# Altium project PCB_ADVANCED.PrjPcb
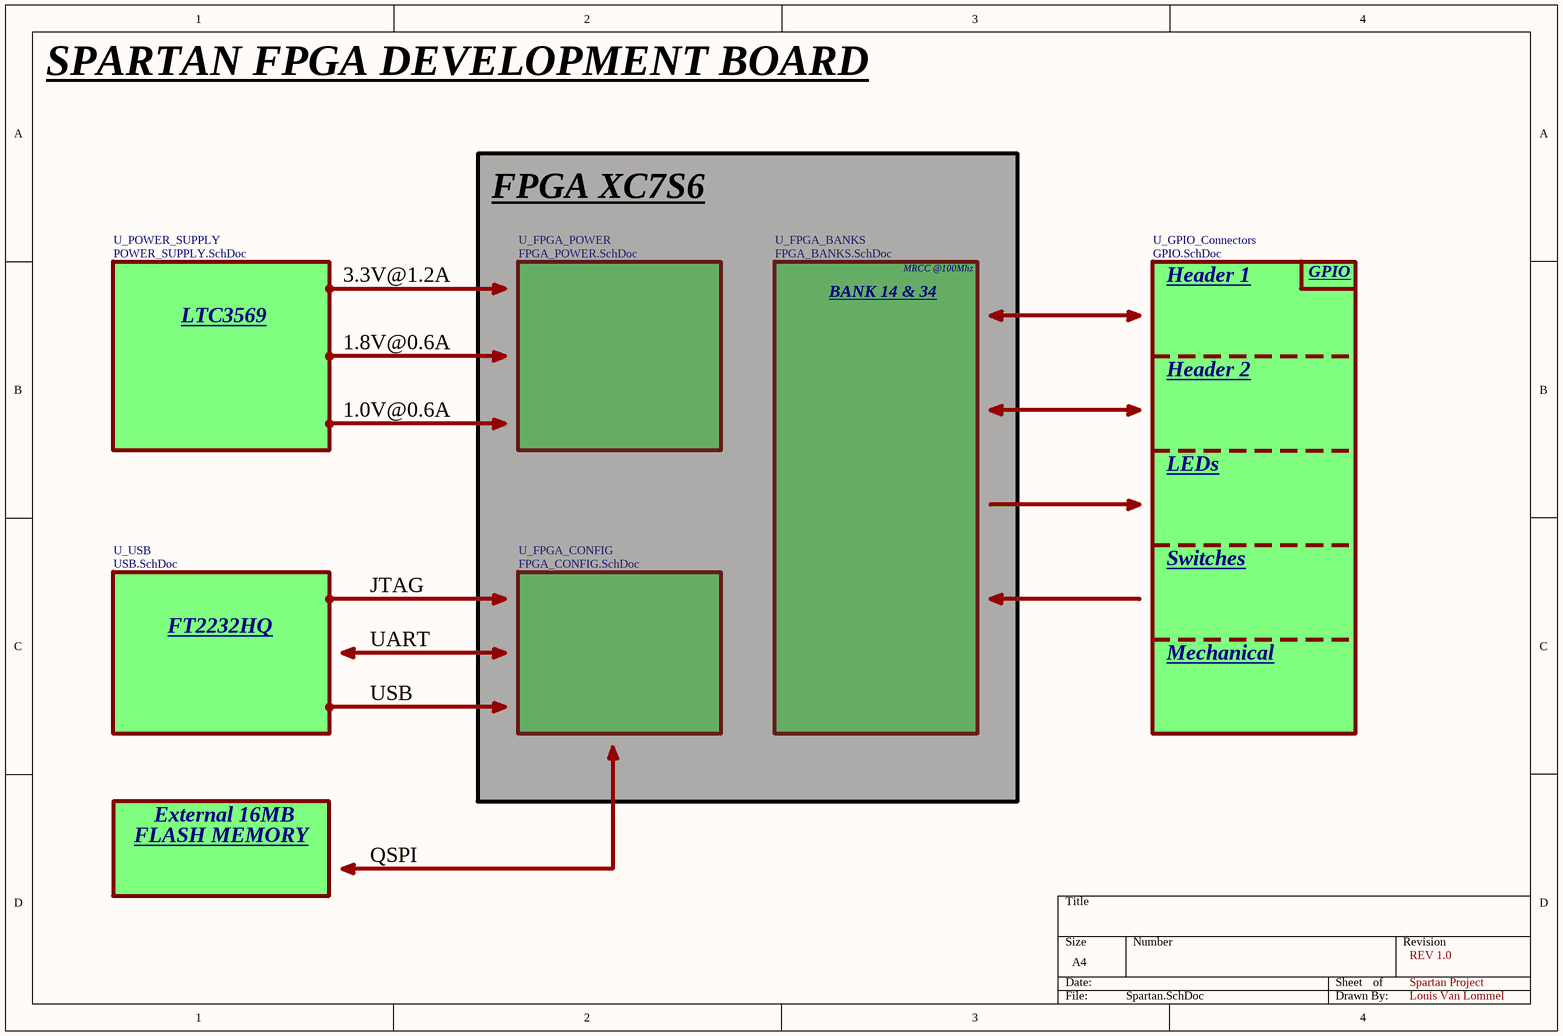
[diagram p0: Spartan.SchDoc]
7 sheets, 179 parts. Net scope: global (net labels, ports and power ports of the same name join across sheets).
Board files: PCB1.PcbDoc, PCB_PANEL.PcbDoc
Sheets:
  Spartan.SchDoc
    U_FPGA_POWER = FPGA_POWER.SchDoc
    U_POWER_SUPPLY = POWER_SUPPLY.SchDoc
    U_USB = USB.SchDoc
    U_FPGA_CONFIG = FPGA_CONFIG.SchDoc
    U_FPGA_BANKS = FPGA_BANKS.SchDoc
    U_GPIO_Connectors = GPIO.SchDoc

## Sheet Spartan.SchDoc
size A4

### Sub-sheets
U_FPGA_BANKS = FPGA_BANKS.SchDoc: no entries
U_FPGA_CONFIG = FPGA_CONFIG.SchDoc: no entries
U_FPGA_POWER = FPGA_POWER.SchDoc: no entries
U_GPIO_Connectors = GPIO.SchDoc: no entries
U_POWER_SUPPLY = POWER_SUPPLY.SchDoc: no entries
U_USB = USB.SchDoc: no entries

### Notes on the sheet
- SPARTAN FPGA DEVELOPMENT BOARD
- FPGA XC7S6
- 3.3V@1.2A
- BANK 14 & 34
- MRCC @100Mhz
- Header 1
- GPIO
- LTC3569
- 1.8V@0.6A
- Header 2
- 1.0V@0.6A
- LEDs
- Switches
- FT2232HQ
- JTAG
- UART
- USB
- Mechanical
- FLASH MEMORY
- External 16MB
- QSPI
- REV 1.0
- Spartan Project
- Louis Van Lommel

## Sheet FPGA_POWER.SchDoc
size A4
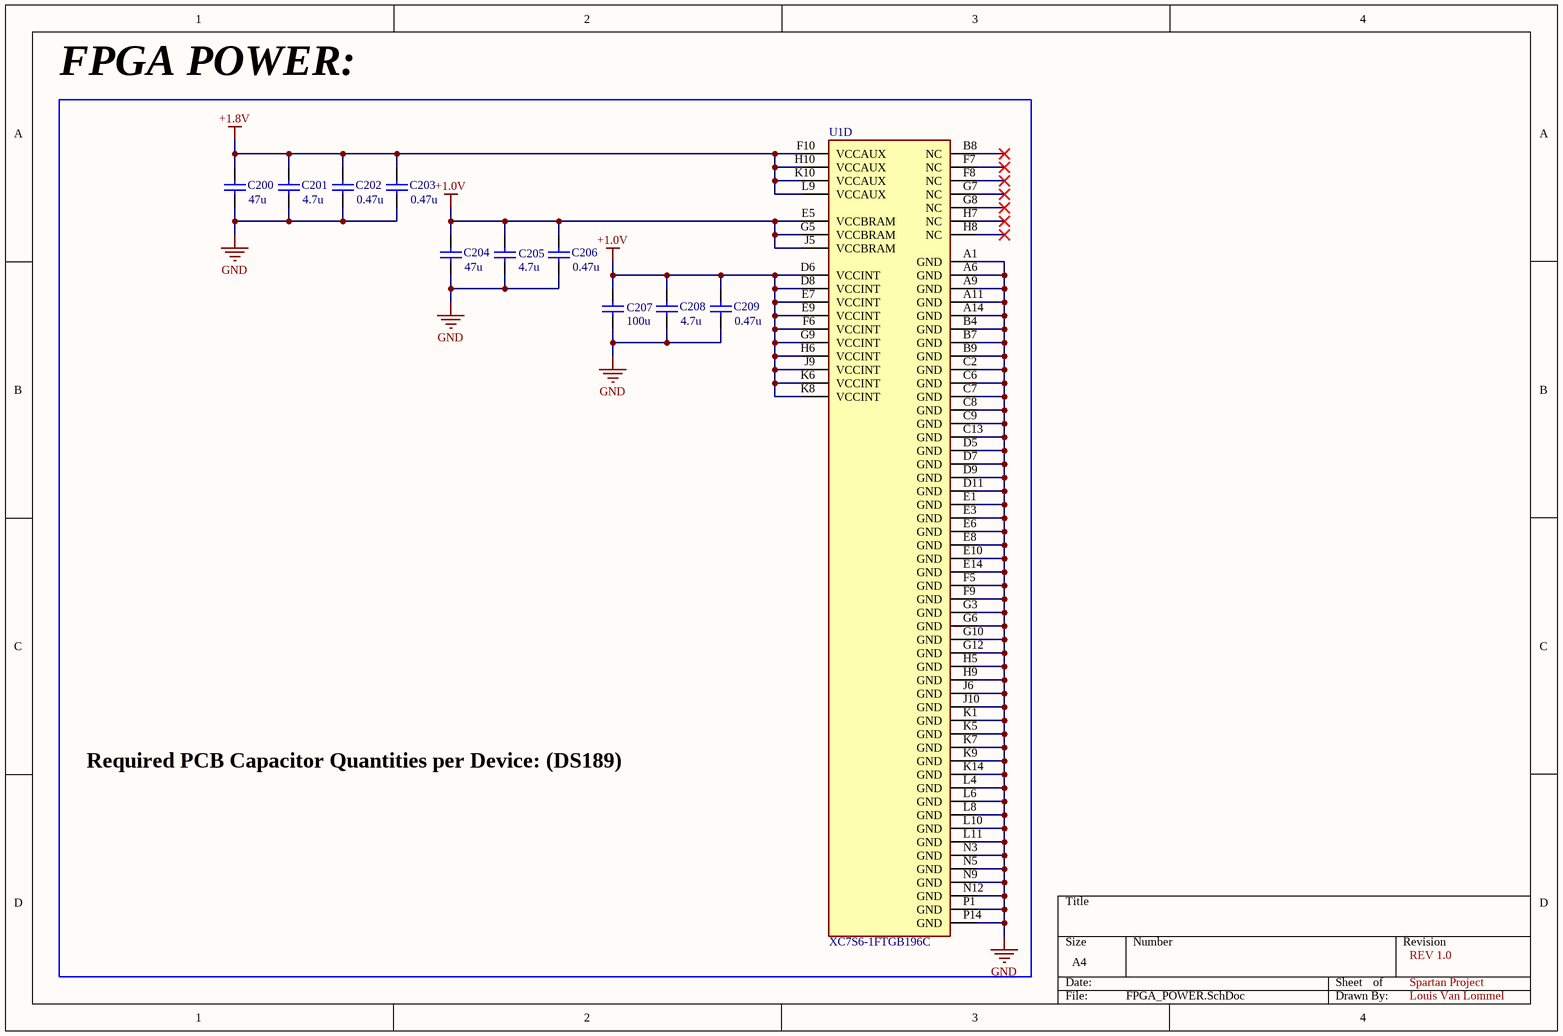
[diagram p1: FPGA_POWER.SchDoc]

### Parts
C200  value 47u  [CAP_0603]  (hidden comment: 47uF)
C201  4.7u  [CAP_0402]
C202  value 0.47u  [CAP_0402]  (hidden comment: 0.47uF)
C203  value 0.47u  [CAP_0402]  (hidden comment: 0.47uF)
C204  value 47u  [CAP_0603]  (hidden comment: 47uF)
C205  4.7u  [CAP_0402]
C206  value 0.47u  [CAP_0402]  (hidden comment: 0.47uF)
C207  value 100u  [CAP_0805]  (hidden comment: 100uF)
C208  4.7u  [CAP_0402]
C209  value 0.47u  [CAP_0402]  (hidden comment: 0.47uF)
U1  XC7S6-1FTGB196C  [FP-XC7S6-1FTGB196C-MFG]  (part D of 4)

### Nets
+1.0V: C204.2 C205.2 C206.2 C207.2 C208.2 C209.2 U1.D6(VCCINT) U1.D8(VCCINT) U1.E5(VCCBRAM) U1.E7(VCCINT) U1.E9(VCCINT) U1.F6(VCCINT) U1.G5(VCCBRAM) U1.G9(VCCINT) U1.H6(VCCINT) U1.J5(VCCBRAM) U1.J9(VCCINT) U1.K6(VCCINT) U1.K8(VCCINT)
+1.8V: C200.2 C201.2 C202.2 C203.2 U1.F10(VCCAUX) U1.H10(VCCAUX) U1.K10(VCCAUX) U1.L9(VCCAUX)
GND: C200.1 C201.1 C202.1 C203.1 C204.1 C205.1 C206.1 C207.1 C208.1 C209.1 U1.A1(GND) U1.A6(GND) U1.A9(GND) U1.A11(GND) U1.A14(GND) U1.B4(GND) U1.B7(GND) U1.B9(GND) U1.C2(GND) U1.C6(GND) U1.C7(GND) U1.C8(GND) U1.C9(GND) U1.C13(GND) U1.D5(GND) U1.D7(GND) U1.D9(GND) U1.D11(GND) U1.E1(GND) U1.E3(GND) U1.E6(GND) U1.E8(GND) U1.E10(GND) U1.E14(GND) U1.F5(GND) U1.F9(GND) U1.G3(GND) U1.G6(GND) U1.G10(GND) U1.G12(GND) U1.H5(GND) U1.H9(GND) U1.J6(GND) U1.J10(GND) U1.K1(GND) U1.K5(GND) U1.K7(GND) U1.K9(GND) U1.K14(GND) U1.L4(GND) U1.L6(GND) U1.L8(GND) U1.L10(GND) U1.L11(GND) U1.N3(GND) U1.N5(GND) U1.N9(GND) U1.N12(GND) U1.P1(GND) U1.P14(GND)

Not connected (* = marked no-connect by the designer): U1 B8(NC)* F7(NC)* F8(NC)* G7(NC)* G8(NC)* H7(NC)* H8(NC)*

### Notes on the sheet
- FPGA POWER:
- Required PCB Capacitor Quantities per Device: (DS189)
- REV 1.0
- Spartan Project
- Louis Van Lommel

### Library data of the parts
C200-C209 = Cap: Capacitor; Published: 8-Jun-2000; LatestRevisionDate: 17-Jul-2002; LatestRevisionNote: Re-released for DXP Platform.; PackageReference: RAD-0.3; Publisher: Altium Limited; PackageDescription: Radial Cap, Thru-Hole; 2 Leads; 0.3 in Pin Spacing
  C201 C205 C208: Value: 4.7u
U1 = CMP-17530-000008-1: Manufacturer: Xilinx; Standoff Height: 0.3mm; Max Supply Voltage: 3.465V; Number Of Logic Elements Cells: 6000; Number Of I/Os: 100; Min Supply Voltage: 0.95V; Ram Size: 180Kbits; Frequency: 200MHz; Max Junction Temp: +85°C; Speed Grade: 1; Propagation Delay: 0.13ns; Number Of Logic Blocks: 938; Lead Free: Yes; Device Class L1: Integrated Circuits (ICs); Category: IC; Ipc Land Pattern Name: BGA196C100P14X14_1500X1500X146; Manufacturer Part Number: XC7S6-1FTGB196C; Temperature Range High: +85°C; ComponentLink2Description: Datasheet; Package: XC7S6-1FTGB196C; Height: 1.55mm; Device Class L2: Embedded Processors and Controllers; Digikey Description: XC7S6-1FTGB196C; Temperature: 0°C to +85°C; Device Class L3: FPGAs - Field Programmable Gate Arrays; Automotive: No; Octopart: https://octopart.com/xc7s6-1ftgb196c-xilinx-81890684; Footprint Url: https://www.xilinx.com/support/documentation/user_guides/ug475_7Series_Pkg_Pinout.pdf; ComponentLink2URL: https://www.xilinx.com/support/documentation/data_sheets/ds189-spartan-7-data-sheet.pdf; RoHS: TRUE; Temperature Range Low: 0°C

## Sheet POWER_SUPPLY.SchDoc
size A4
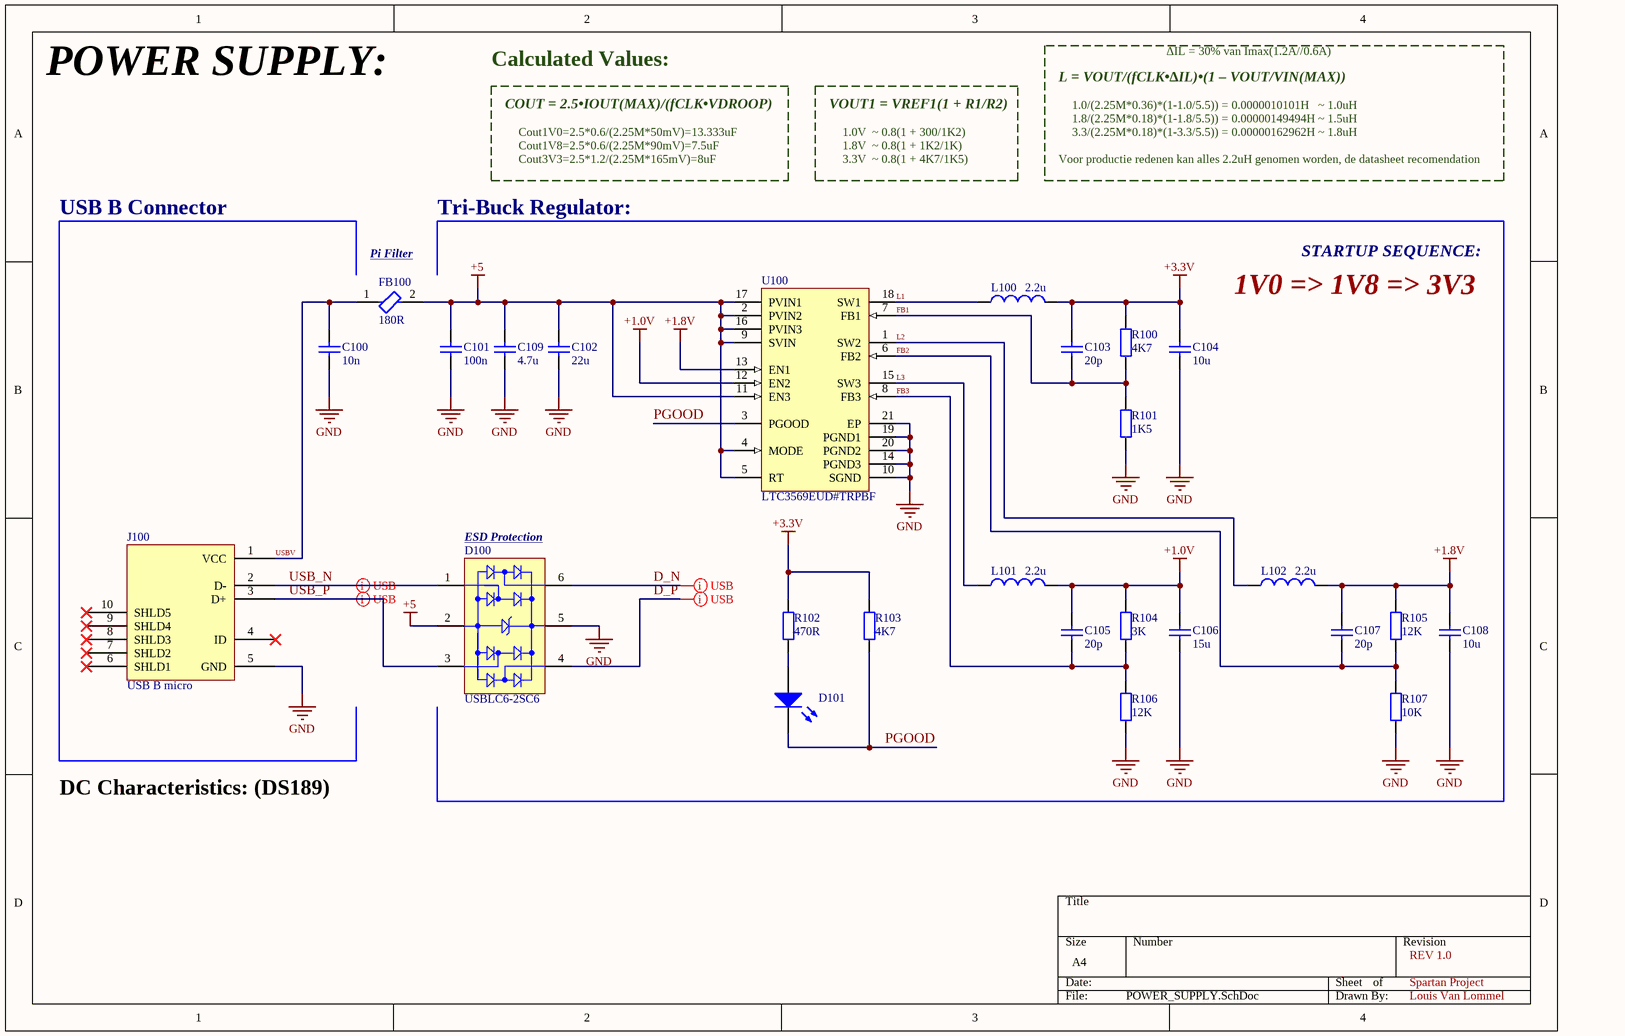
[diagram p2: POWER_SUPPLY.SchDoc]

### Parts
C100  10n  [CAP_0603]
C101  100n  [CAP_0603]
C102  22u  [CAP_1210]
C103  value 20p  [CAP_0603]  (hidden comment: 20pF)
C104  value 10u  [CAP_1210]  (hidden comment: 10uF)
C105  value 20p  [CAP_0603]  (hidden comment: 20pF)
C106  value 15u  [CAP_1210]  (hidden comment: 15uF)
C107  value 20p  [CAP_0603]  (hidden comment: 20pF)
C108  value 10u  [CAP_1210]  (hidden comment: 10uF)
C109  4.7u  [CAP_0603]
D100  USBLC6-2SC6  [STM-SOT23-6L_V]
D101  LED  [LED_0603]  (value not drawn)
FB100  180R  [CAP_0805]
J100  USB B micro  [USB Micro B]
L100  value 2.2u  [IND4x4mm]  (hidden comment: 2.2uH)
L101  value 2.2u  [IND4x4mm]  (hidden comment: 2.2uH)
L102  value 2.2u  [IND4x4mm]  (hidden comment: 2.2uH)
R100  4K7  [RES_0603]
R101  1K5  [RES_0603]
R102  value 470R  [RES_0603]  (hidden comment: 470)
R103  4K7  [RES_0603]
R104  3K  [RES_0603]
R105  12K  [RES_0603]
R106  12K  [RES_0603]
R107  10K  [RES_0603]
U100  LTC3569EUD#TRPBF  [LT-UD-20_N]

### Nets
+1.0V: C105.2 C106.2 L101.2 R104.2 U100.12(EN2)
+1.8V: C107.2 C108.2 L102.2 R105.2 U100.13(EN1)
+3.3V: C103.2 C104.2 L100.2 R100.2 R102.2 R103.2
+5: C101.2 C102.2 C109.2 D100.2(GND) FB100.2 U100.2(PVIN2) U100.4(MODE) U100.5(RT) U100.9(SVIN) U100.11(EN3) U100.16(PVIN3) U100.17(PVIN1)
GND: C100.1 C101.1 C102.1 C104.1 C106.1 C108.1 C109.1 D100.5(VBUS) J100.5(GND) R101.1 R106.1 R107.1 U100.10(SGND) U100.14(PGND3) U100.19(PGND1) U100.20(PGND2) U100.21(EP)
D_N: D100.6(I/O_4)
D_P: D100.4(I/O_3)
FB1: C103.1 R100.1 R101.2 U100.7(FB1)
FB2: C107.1 R105.1 R107.2 U100.6(FB2)
FB3: C105.1 R104.1 R106.2 U100.8(FB3)
L1: L100.1 U100.18(SW1)
L2: L102.1 U100.1(SW2)
L3: L101.1 U100.15(SW3)
PGOOD: D101.2(K) R103.1 U100.3(PGOOD)
USB_N: D100.1(I/O_1) J100.2(D-)
USB_P: D100.3(I/O_2) J100.3(D+)
USBV: C100.2 FB100.1 J100.1(VCC)
NetD101_1: D101.1(A) R102.1

Not connected (* = marked no-connect by the designer): J100 4(ID)* 6(SHLD1)* 7(SHLD2)* 8(SHLD3)* 9(SHLD4)* 10(SHLD5)*

### Layout directives
differential pair: D_N, D_P, USB_N, USB_P

### Notes on the sheet
- POWER SUPPLY:
- Calculated Values:
- COUT = 2.5•IOUT(MAX)/(fCLK•VDROOP)
- VOUT1 = VREF1(1 + R1/R2)
- L = VOUT/(fCLK•∆IL)•(1 – VOUT/VIN(MAX))
- 1.0/(2.25M*0.36)*(1-1.0/5.5)) = 0.0000010101H   ~ 1.0uH
- ∆IL = 30% van Imax(1.2A//0.6A)
- Cout3V3=2.5*1.2/(2.25M*165mV)=8uF
- Cout1V8=2.5*0.6/(2.25M*90mV)=7.5uF
- Cout1V0=2.5*0.6/(2.25M*50mV)=13.333uF
- 1.8V  ~ 0.8(1 + 1K2/1K)
- 3.3V  ~ 0.8(1 + 4K7/1K5)
- 1.0V  ~ 0.8(1 + 300/1K2)
- Voor productie redenen kan alles 2.2uH genomen worden, de datasheet recomendation
- 1.8/(2.25M*0.18)*(1-1.8/5.5)) = 0.00000149494H ~ 1.5uH
- 3.3/(2.25M*0.18)*(1-3.3/5.5)) = 0.00000162962H ~ 1.8uH
- USB B Connector
- Tri-Buck Regulator:
- (near FB100) Pi Filter <https://www.rfwireless-world.com/calculators/Pi-LC-Low-Pass-Filter-calculator.html>
- 1V0 => 1V8 => 3V3
- STARTUP SEQUENCE:
- (near D100) ESD Protection
- DC Characteristics: (DS189)
- REV 1.0
- Spartan Project
- Louis Van Lommel

### Library data of the parts
C100-C109 = Cap: Capacitor; Published: 8-Jun-2000; LatestRevisionDate: 17-Jul-2002; LatestRevisionNote: Re-released for DXP Platform.; PackageReference: RAD-0.3; Publisher: Altium Limited; PackageDescription: Radial Cap, Thru-Hole; 2 Leads; 0.3 in Pin Spacing
  C100: Value: 10n
  C101: Value: 100n
  C102: Value: 22u
  C109: Value: 4.7u
D100 = CMP-2000-05378-1: Very low capacitance ESD protection, 3.5 pF, -40 to 125 degC, 6-Pin SOT23, RoHS, Tape and Reel; Manufacturer: STMicroelectronics; Polarity: Uni-Directional; Clamping Voltage: 17V; Rad Hardened: No; Product Height (mm): 1.3mm; Leakage Current (Max): 0.15uA; Product Length (mm): 3.05mm; Number of Elements: 1; Peak Pulse Current: 5A; Configuration: Dual; Reverse Breakdown Voltage: 6V; Working Voltage (Max): 5V; Capacitance Value: 3.5pF; Suppressor Type: DiodeArrays; Product Depth (mm): 1.75mm; Test Current (It): 1mA; Package / Case: SOT-23; Operating Temperature Max Deg. C: 125C; Package Description: 6-Pin Small Outline Transistor, Body 2.925 x 1.625 mm, Pitch 0.95 mm; Package Reference: SOT23-6L; Datasheet Version: Rev. 5, 10/2011; Operating Temperature Min Deg. C: -40C; Mounting Style: SurfaceMount; Direction Type: Uni-Directional; Mounting: SurfaceMount; Pin Count: 6; Leakage Current: 0.15uA; Packaging: TapeandReel; Operating Temperature Classification: Automotive; Clamping Voltage (Max): 17V; Manufacturer URL: http://www.st.com/; Reverse Stand-off Voltage: 5V; Datasheet URL: http://www.st.com/st-web-ui/static/active/en/resource/technical/document/datasheet/CD00050750.pdf; Working Voltage: 5V; Operating Temp Range: -40Cto125C
D101 = LED0: Typical INFRARED GaAs LED; Published: 8-Jun-2000; LatestRevisionDate: 08-Jul-2005; LatestRevisionNote: Mech Layer 1 removed.; PackageReference: LED-0; Publisher: Altium Limited; PackageDescription: LED; 2 Leads
FB100 = Ferrite Bead: Chip Ferrite Bead, 0402, 1000Ω @ 100MHz, 0.65Ω, 25%, 300mA; DC Current: 200mA; Number of Circuits: 1; Shielding: Unshielded; Impedance: 1kR; DC Resistance (DCR): 650mR; DC Resistance-Max: 1R; Packaging: Tape and Reel; Case Code (Imperial): 0402; Military Standard: Not; Min Operating Temperature: -55°C; Width: 0.5mm; Tolerance: 25%; Material: Ferrite; Number of Lines: 1; Max Current Rating: 300mA; Depth: 0.55mm; Package Quantity: 1; Case/Package: 0402; Series: BLM15AG_SN; Case Code (Metric): 1005; Max Operating Temperature: 125°C; Lead Free: Lead Free; Test Frequency: 100MHz; RoHS Compliant: Yes; Radiation Hardening: No; Number of Pins: 2; Core Material: Ferrite; Current Rating: 300mA; Frequency: 100MHz; Max DC Current: 200mA; REACH SVHC: No SVHC; Length: 1mm; Termination: SMD/SMT; Height: 0.5mm
J100 = USB micro B
L100-L102 = Inductor: Code_IEC: 1005; Published: 8-Jun-2000; LatestRevisionDate: 29-May-2009; LatestRevisionNote: IPC-7351 Footprint Added.; PackageReference: 0402-A; Publisher: Altium Limited; PackageDescription: Chip Inductor; Code_JEITA: 0402
R100-R102 R104-R107 = Res2: Resistor; Published: 8-Jun-2000; LatestRevisionDate: 17-Jul-2002; LatestRevisionNote: Re-released for DXP Platform.; PackageReference: AXIAL-0.4; Publisher: Altium Limited; PackageDescription: Axial Device, Thru-Hole; 2 Leads; 0.4 in Pin Spacing
  R100: Value: 4K7
  R101: Value: 1K5
  R104: Value: 3K
  R105 R106: Value: 12K
  R107: Value: 10K
R103 = Res2: DNP R103; Published: 8-Jun-2000; LatestRevisionDate: 17-Jul-2002; LatestRevisionNote: Re-released for DXP Platform.; PackageReference: AXIAL-0.4; Publisher: Altium Limited; PackageDescription: Axial Device, Thru-Hole; 2 Leads; 0.4 in Pin Spacing; Value: 4K7; Parameter 1: *; Parameter 2: *
U100 = CMP-0492-02156-1: Triple Buck Regulator with 1.2 A and Two 600 mA Outputs and Individual Programmable References, 20-pin QFN (UD-20), -40 to 125 degC, Pb-Free, Tape and Reel; Manufacturer: Linear Technology; Frequency Adjust Range: 1MHz - 3MHz; Number of Outputs: 3; ComponentLink3URL: http://cds.linear.com/docs/en/packaging/QFN_20_05-08-1720.pdf; ComponentLink1Description: Manufacturer URL; ComponentLink2Description: Datasheet; PackageReference: UD-20; Mounting Technology: Surface Mount; Packing: Tape and Reel; PartNumber: LTC3569EUD#TRPBF; ComponentLink1URL: http://www.linear.com/; RoHS: TRUE; PackageVersion: Rev. A, 06/2010; ComponentLink2URL: http://cds.linear.com/docs/en/datasheet/3569fd.pdf; DatasheetVersion: Rev. D; PackageDescription: 20-Pin Plastic QFN, Body 3 x 3 mm, Pitch 0.4 mm; ComponentLink3Description: Package Specification

## Sheet USB.SchDoc
size A4
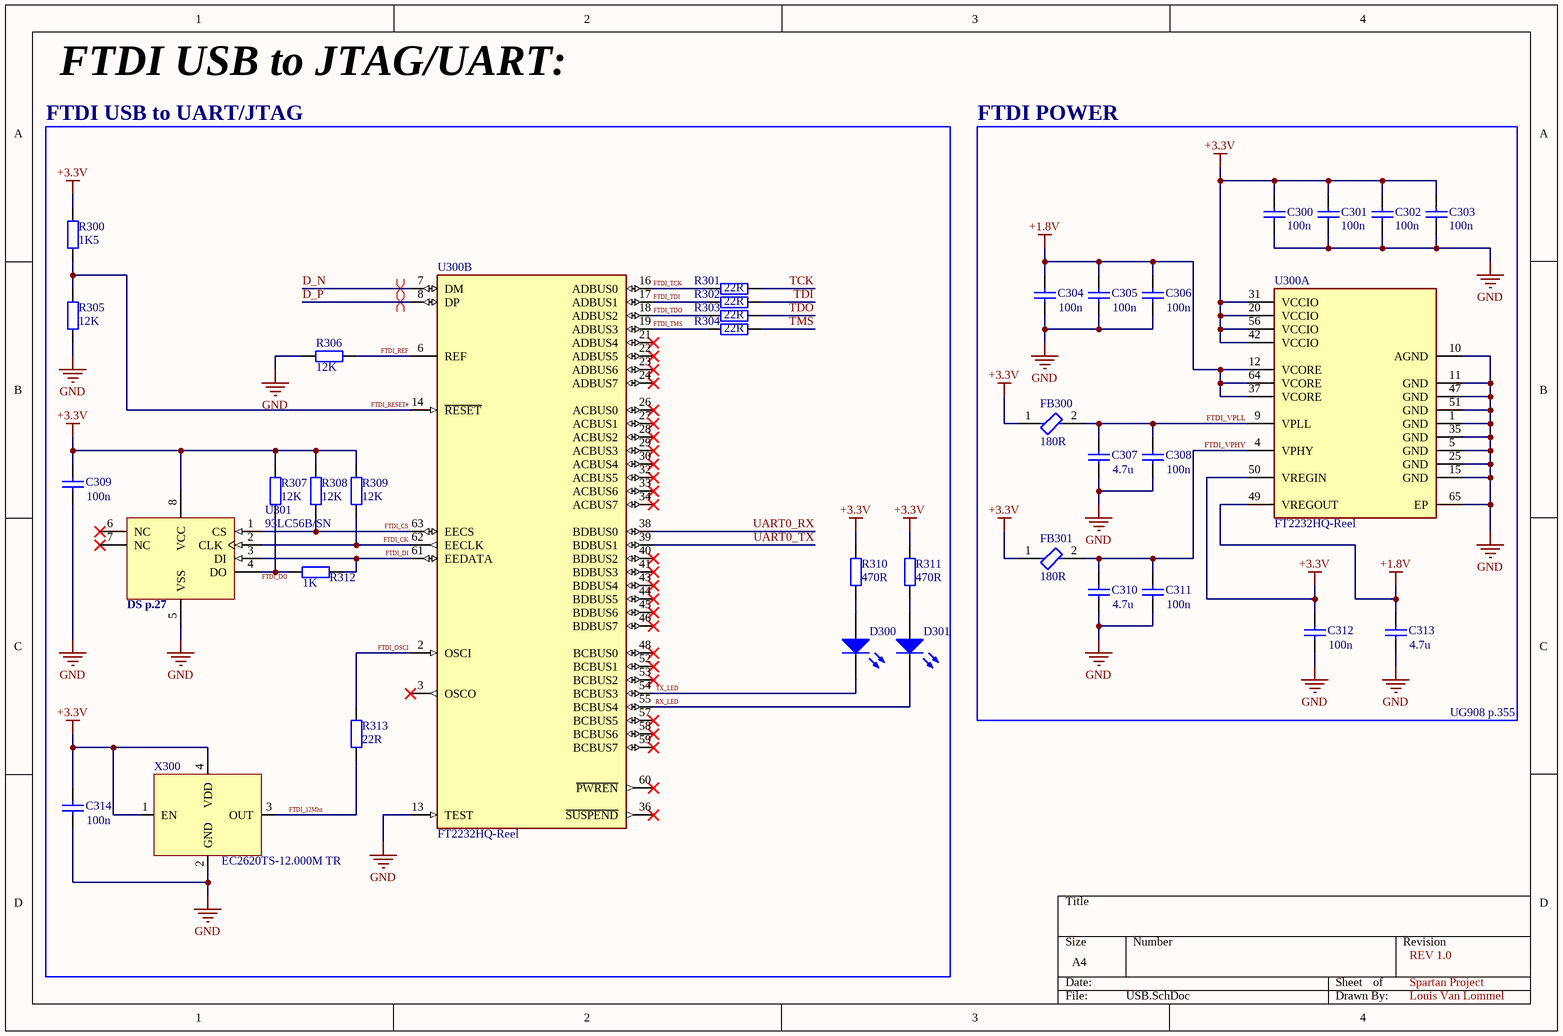
[diagram p3: USB.SchDoc]

### Parts
C300  100n  [CAP_0603]
C301  100n  [CAP_0603]
C302  100n  [CAP_0603]
C303  100n  [CAP_0603]
C304  100n  [CAP_0603]
C305  100n  [CAP_0603]
C306  100n  [CAP_0603]
C307  4.7u  [CAP_0603]
C308  100n  [CAP_0603]
C309  100n  [CAP_0603]
C310  4.7u  [CAP_0603]
C311  100n  [CAP_0603]
C312  100n  [CAP_0603]
C313  4.7u  [CAP_0603]
C314  100n  [CAP_0603]
D300  LED  [LED_0603]  (value not drawn)
D301  LED  [LED_0603]  (value not drawn)
FB300  180R  [CAP_0805]
FB301  180R  [CAP_0805]
R300  1K5  [RES_0603]
R301  value 22R  [RES_0603]  (hidden comment: 22)
R302  value 22R  [RES_0603]  (hidden comment: 22)
R303  value 22R  [RES_0603]  (hidden comment: 22)
R304  value 22R  [RES_0603]  (hidden comment: 22)
R305  12K  [RES_0603]
R306  12K  [RES_0603]
R307  12K  [RES_0603]
R308  12K  [RES_0603]
R309  12K  [RES_0603]
R310  value 470R  [RES_0603]  (hidden comment: 470)
R311  value 470R  [RES_0603]  (hidden comment: 470)
R312  1K  [RES_0603]
R313  value 22R  [RES_0603]  (hidden comment: 22)
U300  FT2232HQ-Reel  [FP-FT2232HQ-Reel-MFG]  (parts A,B of 2)
U301  93LC56B/SN  [SOIC8]
X300  EC2620TS-12.000M TR  [7x5mm Crystal]

### Blocks framed on the sheet
FTDI USB to UART/JTAG: C309 C314 D300 D301 R300-R313 U300 U301 X300
FTDI POWER: C300-C308 C310-C313 FB300 FB301 U300

### Nets
+1.8V: C304.2 C305.2 C306.2 C313.2 U300.12(VCORE) U300.37(VCORE) U300.49(VREGOUT) U300.64(VCORE)
+3.3V: C300.2 C301.2 C302.2 C303.2 C309.2 C312.2 C314.2 FB300.1 FB301.1 R300.2 R307.1 R308.1 R309.1 R310.2 R311.2 U300.20(VCCIO) U300.31(VCCIO) U300.42(VCCIO) U300.50(VREGIN) U300.56(VCCIO) U301.8(VCC) X300.1(EN) X300.4(VDD)
GND: C300.1 C301.1 C302.1 C303.1 C304.1 C305.1 C306.1 C307.1 C308.1 C309.1 C310.1 C311.1 C312.1 C313.1 C314.1 R305.1 R306.1 U300.1(GND) U300.5(GND) U300.10(AGND) U300.11(GND) U300.13(TEST) U300.15(GND) U300.25(GND) U300.35(GND) U300.47(GND) U300.51(GND) U300.65(EP) U301.5(VSS) X300.2(GND)
D_N: U300.7(DM)
D_P: U300.8(DP)
FTDI_12Mhz: R313.2 X300.3(OUT)
FTDI_CK: R309.2 U300.62(EECLK) U301.2(CLK)
FTDI_CS: R308.2 U300.63(EECS) U301.1(CS)
FTDI_DI: R312.1 U300.61(EEDATA) U301.3(DI)
FTDI_DO: R307.2 R312.2 U301.4(DO)
FTDI_OSCI: R313.1 U300.2(OSCI)
FTDI_REF: R306.2 U300.6(REF)
FTDI_RESET#: R300.1 R305.2 U300.14(~{RESET})
FTDI_TCK: R301.2 U300.16(ADBUS0)
FTDI_TDI: R302.2 U300.17(ADBUS1)
FTDI_TDO: R303.2 U300.18(ADBUS2)
FTDI_TMS: R304.2 U300.19(ADBUS3)
FTDI_VPHY: C310.2 C311.2 FB301.2 U300.4(VPHY)
FTDI_VPLL: C307.2 C308.2 FB300.2 U300.9(VPLL)
RX_LED: D301.2(K) U300.55(BCBUS4)
TCK: R301.1
TDI: R302.1
TDO: R303.1
TMS: R304.1
TX_LED: D300.2(K) U300.54(BCBUS3)
UART0_RX: U300.38(BDBUS0)
UART0_TX: U300.39(BDBUS1)
NetD300_1: D300.1(A) R310.1
NetD301_1: D301.1(A) R311.1

Not connected (* = marked no-connect by the designer): U300 3(OSCO)* 21(ADBUS4)* 22(ADBUS5)* 23(ADBUS6)* 24(ADBUS7)* 26(ACBUS0)* 27(ACBUS1)* 28(ACBUS2)* 29(ACBUS3)* 30(ACBUS4)* 32(ACBUS5)* 33(ACBUS6)* 34(ACBUS7)* 36(~{SUSPEND})* 40(BDBUS2)* 41(BDBUS3)* 43(BDBUS4)* 44(BDBUS5)* 45(BDBUS6)* 46(BDBUS7)* 48(BCBUS0)* 52(BCBUS1)* 53(BCBUS2)* 57(BCBUS5)* 58(BCBUS6)* 59(BCBUS7)* 60(~{PWREN})*; U301 6(NC)* 7(NC)*

### Layout directives
differential pair: D_N, D_P

### Notes on the sheet
- FTDI USB to JTAG/UART:
- (near U301) DS p.27
- UG908 p.355
- REV 1.0
- Spartan Project
- Louis Van Lommel

### Library data of the parts
C300-C314 = Cap: Capacitor; Published: 8-Jun-2000; LatestRevisionDate: 17-Jul-2002; LatestRevisionNote: Re-released for DXP Platform.; PackageReference: RAD-0.3; Publisher: Altium Limited; PackageDescription: Radial Cap, Thru-Hole; 2 Leads; 0.3 in Pin Spacing
  C300-C306 C308 C309 C311 C312 C314: Value: 100n
  C307 C310 C313: Value: 4.7u
D300 D301 = LED0: Typical INFRARED GaAs LED; Published: 8-Jun-2000; LatestRevisionDate: 08-Jul-2005; LatestRevisionNote: Mech Layer 1 removed.; PackageReference: LED-0; Publisher: Altium Limited; PackageDescription: LED; 2 Leads
FB300 FB301 = Ferrite Bead: as FB100 on sheet POWER_SUPPLY; Packaging: Tape and Reel; Case Code (Imperial): 0402; Military Standard: Not; Min Operating Temperature: -55°C; Width: 0.5mm; Tolerance: 25%; Material: Ferrite; Number of Lines: 1; Max Current Rating: 300mA; Depth: 0.55mm; Package Quantity: 1; Case/Package: 0402; Series: BLM15AG_SN; Case Code (Metric): 1005; Max Operating Temperature: 125°C; Lead Free: Lead Free; Test Frequency: 100MHz; RoHS Compliant: Yes; Radiation Hardening: No; Number of Pins: 2; Core Material: Ferrite; Current Rating: 300mA; Frequency: 100MHz; Max DC Current: 200mA; REACH SVHC: No SVHC; Length: 1mm; Termination: SMD/SMT; Height: 0.5mm
R300-R313 = Res2: Resistor; Published: 8-Jun-2000; LatestRevisionDate: 17-Jul-2002; LatestRevisionNote: Re-released for DXP Platform.; PackageReference: AXIAL-0.4; Publisher: Altium Limited; PackageDescription: Axial Device, Thru-Hole; 2 Leads; 0.4 in Pin Spacing
  R300: Value: 1K5
  R305-R309: Value: 12K
  R312: Value: 1K
U300 = CMP-0078-00004-5: IC USB HS DUAL UART/FIFO 64-QFN; Manufacturer: FTDI; Min Supply Voltage: 1.62V; Ciiva Ids: 1315829; Nominal Supply Current: 5-70mA; Standoff Height: 0mm; Import Ts: 1521843541; Number Of Ports: 1; Max Supply Voltage: 3.63V; Data Rate: 480Mbits/s; Interface: I2C,SPI,UART,USB,RS-232,RS-485,RS-422,Other; Usb Standard: USB 2.0; Octopart: https://octopart.com/ft2232hq-reel-ftdi-19172126; Ipc Land Pattern Name: QFN50P900X900X85-64; Ambient Temperature Range High: +85°C; RoHS: TRUE; Manufacturer Part Number: FT2232HQ-Reel; Automotive: No; Footprint Url: https://www.ftdichip.com/Support/Documents/TechnicalNotes/TN_166%20FTDI%20Example%20IC%20PCB%20Footprints.pdf; Temperature Range High: +85°C; ComponentLink2Description: Datasheet; Ambient Temperature Range Low: -40°C; Mouser Description: USB Interface IC USB HS to Dual UART/ FIFO/SPI/JTAG/I2C; ComponentLink2URL: https://www.ftdichip.com/Support/Documents/DataSheets/ICs/DS_FT2232H.pdf; Digikey Description: IC USB HS DUAL UART/FIFO 64-QFN; Release Date: 1383921489; Height: 0.9mm; Lead Free: Yes; Package: QFN64; Device Class L1: Integrated Circuits (ICs); Temperature: -40°C to +85°C; Temperature Range Low: -40°C; Category: IC; Device Class L2: Interface ICs; Device Class L3: USB Interface ICs
U301 = MEM-SEEPROM-93AA46B-P-8: 2K, 128x16-bit, 2.5V Microwire Serial EEPROM, 8-Pin SOIC 150mil, Commercial Temperature; DatasheetVersion: revF, May-2008; PackageVersion: revBB, Aug-2009; PackageReference: SOIC-SN8; PackageDescription: 8-Lead Plastic Small Outline (SN) - Narrow, 3.90mm Body [SOIC]; Code_IPC: SOIC127P600-8; Code_JEDEC: MS-012
X300 = Oscillator: 12Mhz oscillator

## Sheet FPGA_CONFIG.SchDoc
size A4
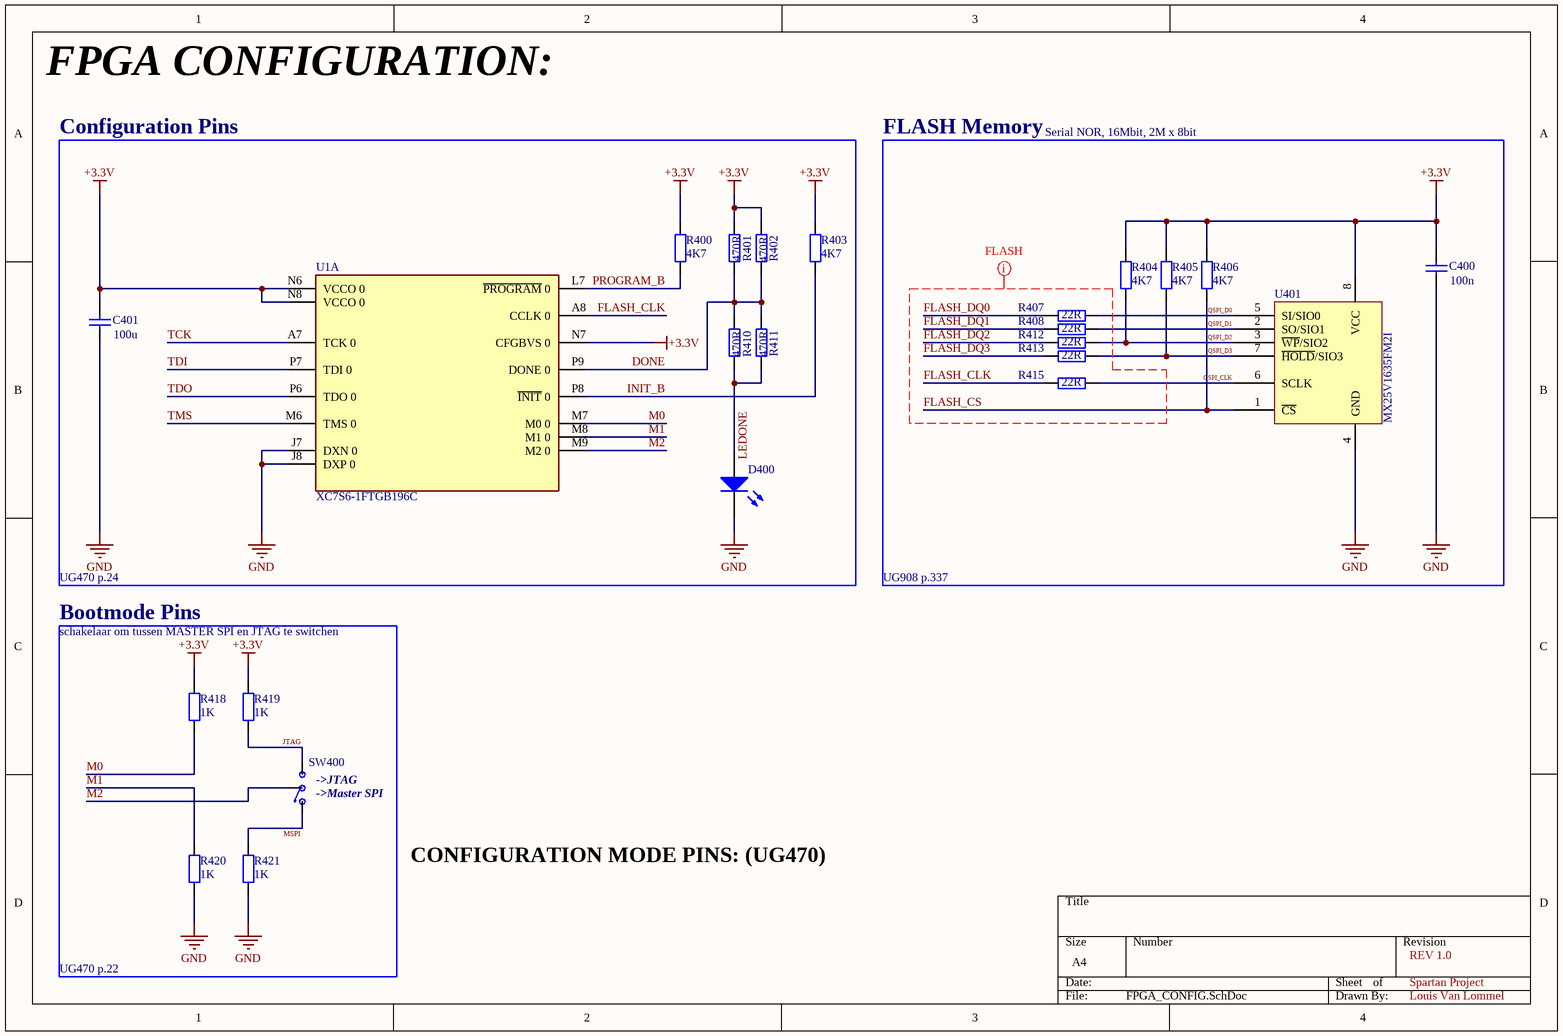
[diagram p4: FPGA_CONFIG.SchDoc]

### Parts
C400  100n  [CAP_0603]
C401  value 100u  [CAP_0805]  (hidden comment: 100uF)
D400  LED  [LED_0603]  (value not drawn)
R400  4K7  [RES_0603]
R401  value 470R  [RES_0603]  (hidden comment: 470)
R402  value 470R  [RES_0603]  (hidden comment: 470)
R403  4K7  [RES_0603]
R404  4K7  [RES_0603]
R405  4K7  [RES_0603]
R406  4K7  [RES_0603]
R407  value 22R  [RES_0603]  (hidden comment: 22)
R408  value 22R  [RES_0603]  (hidden comment: 22)
R410  value 470R  [RES_0603]  (hidden comment: 470)
R411  value 470R  [RES_0603]  (hidden comment: 470)
R412  value 22R  [RES_0603]  (hidden comment: 22)
R413  value 22R  [RES_0603]  (hidden comment: 22)
R415  value 22R  [RES_0603]  (hidden comment: 22)
R418  1K  [RES_0603]
R419  1K  [RES_0603]
R420  1K  [RES_0603]
R421  1K  [RES_0603]
SW400  SPDT SW  [SPDT SWITCH]  (value not drawn)
U1  XC7S6-1FTGB196C  [FP-XC7S6-1FTGB196C-MFG]  (part A of 4)
U401  MX25V1635FM2I  [SOP-8]

### Blocks framed on the sheet
Configuration Pins: C401 D400 R400-R403 R410 R411 U1
FLASH Memory: C400 R404-R408 R412 R413 R415 U401
Bootmode Pins: R418-R421 SW400

### Nets
+3.3V: C400.2 C401.2 R400.2 R401.2 R402.2 R403.2 R404.2 R405.2 R406.2 R418.2 R419.2 U1.N6(VCCO_0) U1.N7(CFGBVS_0) U1.N8(VCCO_0) U401.8(VCC)
GND: C400.1 C401.1 D400.2(K) R420.1 R421.1 U1.J7(DXN_0) U1.J8(DXP_0) U401.4(GND)
DONE: R401.1 R402.1 R410.2 R411.2 U1.P9(DONE_0)
FLASH_CLK: R415.2 U1.A8(CCLK_0)
FLASH_CS: R406.1 U401.1(~{CS})
FLASH_DQ0: R407.2
FLASH_DQ1: R408.2
FLASH_DQ2: R412.2
FLASH_DQ3: R413.2
INIT_B: R403.1 U1.P8(~{INIT}_0)
JTAG: R419.1 SW400.1
LEDONE: D400.1(A) R410.1 R411.1
M0: R418.1 U1.M7(M0_0)
M1: R420.2 U1.M8(M1_0)
M2: SW400.2 U1.M9(M2_0)
MSPI: R421.2 SW400.3
PROGRAM_B: R400.1 U1.L7(~{PROGRAM}_0)
QSPI_CLK: R415.1 U401.6(SCLK)
QSPI_D0: R407.1 U401.5(SI/SIO0)
QSPI_D1: R408.1 U401.2(SO/SIO1)
QSPI_D2: R404.1 R412.1 U401.3(~{WP}/SIO2)
QSPI_D3: R405.1 R413.1 U401.7(~{HOLD}/SIO3)
TCK: U1.A7(TCK_0)
TDI: U1.P7(TDI_0)
TDO: U1.P6(TDO_0)
TMS: U1.M6(TMS_0)

### Layout directives
mark named FLASH: FLASH_CLK, FLASH_CS, FLASH_DQ0, FLASH_DQ1, FLASH_DQ2, FLASH_DQ3

### Notes on the sheet
- FPGA CONFIGURATION:
- Serial NOR, 16Mbit, 2M x 8bit
- UG470 p.24
- UG908 p.337
- schakelaar om tussen MASTER SPI en JTAG te switchen
- (near SW400) ->JTAG
- (near SW400) ->Master SPI
- CONFIGURATION MODE PINS: (UG470)
- UG470 p.22
- REV 1.0
- Spartan Project
- Louis Van Lommel

### Library data of the parts
C400 C401 = Cap: Capacitor; Published: 8-Jun-2000; LatestRevisionDate: 17-Jul-2002; LatestRevisionNote: Re-released for DXP Platform.; PackageReference: RAD-0.3; Publisher: Altium Limited; PackageDescription: Radial Cap, Thru-Hole; 2 Leads; 0.3 in Pin Spacing
  C400: Value: 100n
D400 = LED0: Typical INFRARED GaAs LED; Published: 8-Jun-2000; LatestRevisionDate: 08-Jul-2005; LatestRevisionNote: Mech Layer 1 removed.; PackageReference: LED-0; Publisher: Altium Limited; PackageDescription: LED; 2 Leads
R400-R408 R410-R413 R415 R418-R421 = Res2: Resistor; Published: 8-Jun-2000; LatestRevisionDate: 17-Jul-2002; LatestRevisionNote: Re-released for DXP Platform.; PackageReference: AXIAL-0.4; Publisher: Altium Limited; PackageDescription: Axial Device, Thru-Hole; 2 Leads; 0.4 in Pin Spacing
  R400 R403-R406: Value: 4K7
  R418-R421: Value: 1K
U1 = CMP-17530-000008-1: as U1 on sheet FPGA_POWER; Lead Free: Yes; Device Class L1: Integrated Circuits (ICs); Category: IC; Ipc Land Pattern Name: BGA196C100P14X14_1500X1500X146; Manufacturer Part Number: XC7S6-1FTGB196C; Temperature Range High: +85°C; ComponentLink2Description: Datasheet; Package: XC7S6-1FTGB196C; Height: 1.55mm; Device Class L2: Embedded Processors and Controllers; Digikey Description: XC7S6-1FTGB196C; Temperature: 0°C to +85°C; Device Class L3: FPGAs - Field Programmable Gate Arrays; Automotive: No; Octopart: https://octopart.com/xc7s6-1ftgb196c-xilinx-81890684; Footprint Url: https://www.xilinx.com/support/documentation/user_guides/ug475_7Series_Pkg_Pinout.pdf; ComponentLink2URL: https://www.xilinx.com/support/documentation/data_sheets/ds189-spartan-7-data-sheet.pdf; RoHS: TRUE; Temperature Range Low: 0°C
U401 = MACRONIX MX25V1635FM2I: Flash Memory, Serial NOR, 16 Mbit, 2M x 8bit, SPI, SOP, 8 Pins

## Sheet FPGA_BANKS.SchDoc
size A4
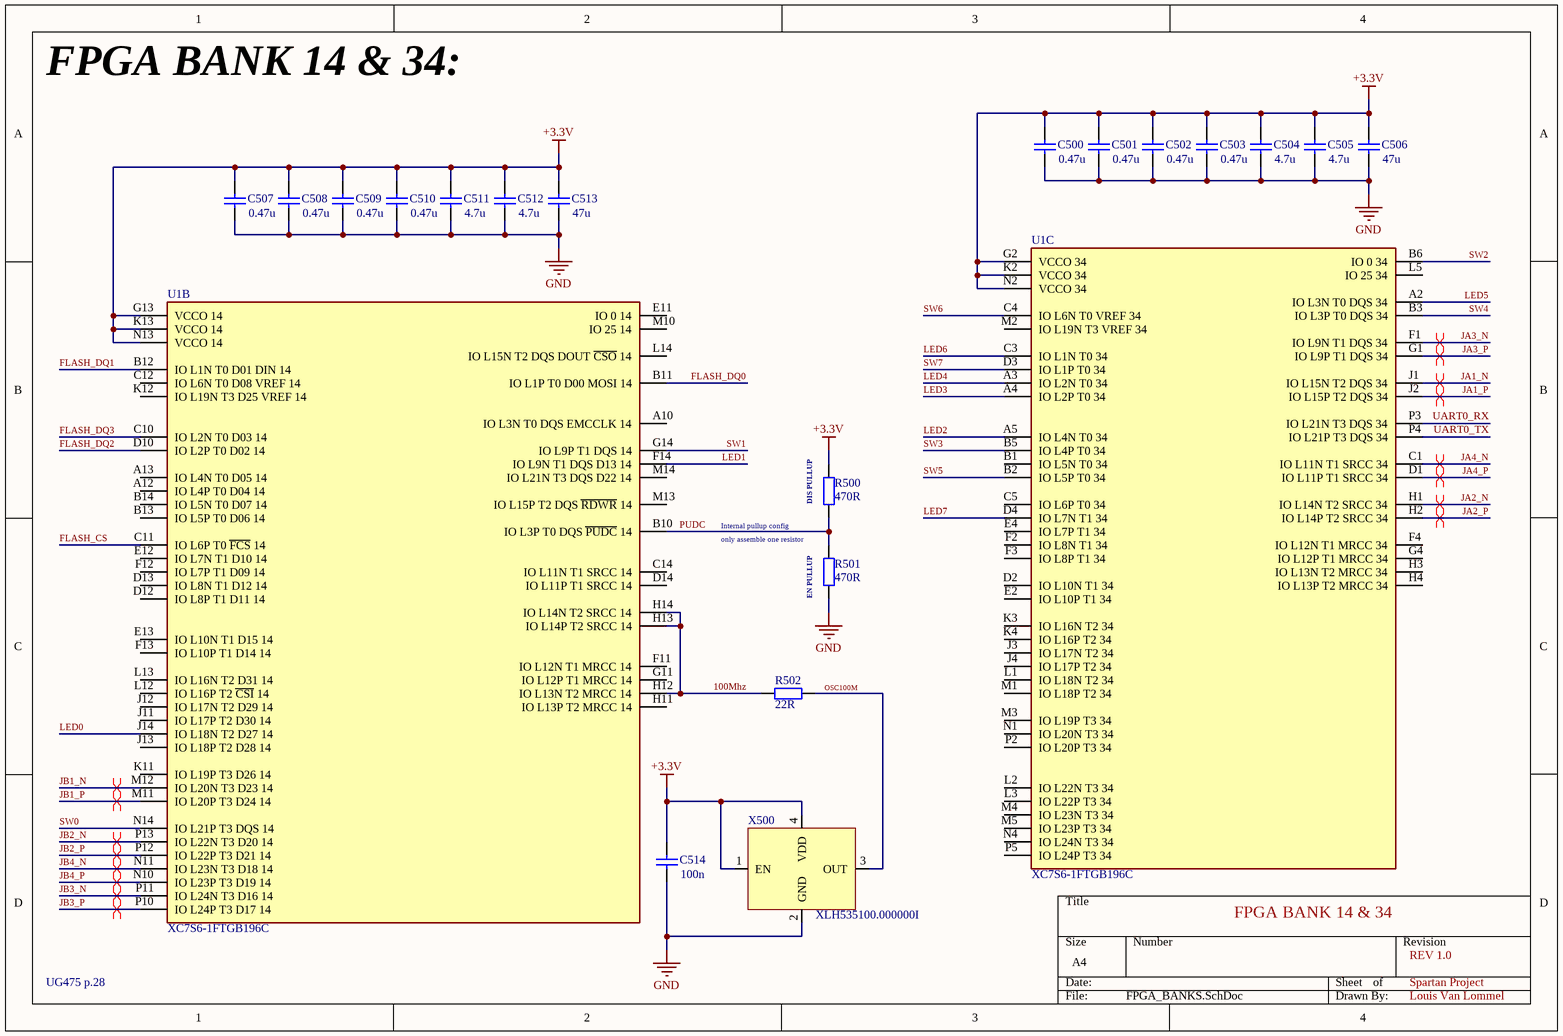
[diagram p5: FPGA_BANKS.SchDoc]

### Parts
C500  value 0.47u  [CAP_0402]  (hidden comment: 0.47uF)
C501  value 0.47u  [CAP_0402]  (hidden comment: 0.47uF)
C502  value 0.47u  [CAP_0402]  (hidden comment: 0.47uF)
C503  value 0.47u  [CAP_0402]  (hidden comment: 0.47uF)
C504  4.7u  [CAP_0402]
C505  4.7u  [CAP_0402]
C506  value 47u  [CAP_0603]  (hidden comment: 47uF)
C507  value 0.47u  [CAP_0402]  (hidden comment: 0.47uF)
C508  value 0.47u  [CAP_0402]  (hidden comment: 0.47uF)
C509  value 0.47u  [CAP_0402]  (hidden comment: 0.47uF)
C510  value 0.47u  [CAP_0402]  (hidden comment: 0.47uF)
C511  4.7u  [CAP_0402]
C512  4.7u  [CAP_0402]
C513  value 47u  [CAP_0603]  (hidden comment: 47uF)
C514  100n  [CAP_0603]
R500  value 470R  [RES_0603]  (hidden comment: 470)
R501  value 470R  [RES_0603]  (hidden comment: 470 DNP)
R502  value 22R  [RES_0603]  (hidden comment: 22)
U1  XC7S6-1FTGB196C  [FP-XC7S6-1FTGB196C-MFG]  (parts B,C of 4)
X500  XLH535100.000000I  [5X3.2MM CRYSTAL]

### Nets
+3.3V: C500.2 C501.2 C502.2 C503.2 C504.2 C505.2 C506.2 C507.2 C508.2 C509.2 C510.2 C511.2 C512.2 C513.2 C514.2 R500.2 U1.G2(VCCO_34) U1.G13(VCCO_14) U1.K2(VCCO_34) U1.K13(VCCO_14) U1.N2(VCCO_34) U1.N13(VCCO_14) X500.1(EN) X500.4(VDD)
GND: C500.1 C501.1 C502.1 C503.1 C504.1 C505.1 C506.1 C507.1 C508.1 C509.1 C510.1 C511.1 C512.1 C513.1 C514.1 R501.1 X500.2(GND)
100Mhz: R502.2 U1.H12(IO_L13N_T2_MRCC_14) U1.H13(IO_L14P_T2_SRCC_14) U1.H14(IO_L14N_T2_SRCC_14)
FLASH_CS: U1.C11(IO_L6P_T0_~{FCS}_14)
FLASH_DQ0: U1.B11(IO_L1P_T0_D00_MOSI_14)
FLASH_DQ1: U1.B12(IO_L1N_T0_D01_DIN_14)
FLASH_DQ2: U1.D10(IO_L2P_T0_D02_14)
FLASH_DQ3: U1.C10(IO_L2N_T0_D03_14)
JA1_N: U1.J1(IO_L15N_T2_DQS_34)
JA1_P: U1.J2(IO_L15P_T2_DQS_34)
JA2_N: U1.H1(IO_L14N_T2_SRCC_34)
JA2_P: U1.H2(IO_L14P_T2_SRCC_34)
JA3_N: U1.F1(IO_L9N_T1_DQS_34)
JA3_P: U1.G1(IO_L9P_T1_DQS_34)
JA4_N: U1.C1(IO_L11N_T1_SRCC_34)
JA4_P: U1.D1(IO_L11P_T1_SRCC_34)
JB1_N: U1.M12(IO_L20N_T3_D23_14)
JB1_P: U1.M11(IO_L20P_T3_D24_14)
JB2_N: U1.P13(IO_L22N_T3_D20_14)
JB2_P: U1.P12(IO_L22P_T3_D21_14)
JB3_N: U1.P11(IO_L24N_T3_D16_14)
JB3_P: U1.P10(IO_L24P_T3_D17_14)
JB4_N: U1.N11(IO_L23N_T3_D18_14)
JB4_P: U1.N10(IO_L23P_T3_D19_14)
LED0: U1.J14(IO_L18N_T2_D27_14)
LED1: U1.F14(IO_L9N_T1_DQS_D13_14)
LED2: U1.A5(IO_L4N_T0_34)
LED3: U1.A4(IO_L2P_T0_34)
LED4: U1.A3(IO_L2N_T0_34)
LED5: U1.A2(IO_L3N_T0_DQS_34)
LED6: U1.C3(IO_L1N_T0_34)
LED7: U1.D4(IO_L7N_T1_34)
OSC100M: R502.1 X500.3(OUT)
PUDC: R500.1 R501.2 U1.B10(IO_L3P_T0_DQS_~{PUDC}_14)
SW0: U1.N14(IO_L21P_T3_DQS_14)
SW1: U1.G14(IO_L9P_T1_DQS_14)
SW2: U1.B6(IO_0_34)
SW3: U1.B5(IO_L4P_T0_34)
SW4: U1.B3(IO_L3P_T0_DQS_34)
SW5: U1.B2(IO_L5P_T0_34)
SW6: U1.C4(IO_L6N_T0_VREF_34)
SW7: U1.D3(IO_L1P_T0_34)
UART0_RX: U1.P3(IO_L21N_T3_DQS_34)
UART0_TX: U1.P4(IO_L21P_T3_DQS_34)

Not connected (* = marked no-connect by the designer): U1 A10(IO_L3N_T0_DQS_EMCCLK_14) A12(IO_L4P_T0_D04_14) A13(IO_L4N_T0_D05_14) B1(IO_L5N_T0_34) B13(IO_L5P_T0_D06_14) B14(IO_L5N_T0_D07_14) C5(IO_L6P_T0_34) C12(IO_L6N_T0_D08_VREF_14) C14(IO_L11N_T1_SRCC_14) D2(IO_L10N_T1_34) D12(IO_L8P_T1_D11_14) D13(IO_L8N_T1_D12_14) D14(IO_L11P_T1_SRCC_14) E2(IO_L10P_T1_34) E4(IO_L7P_T1_34) E11(IO_0_14) E12(IO_L7N_T1_D10_14) E13(IO_L10N_T1_D15_14) F2(IO_L8N_T1_34) F3(IO_L8P_T1_34) F4(IO_L12N_T1_MRCC_34) F11(IO_L12N_T1_MRCC_14) F12(IO_L7P_T1_D09_14) F13(IO_L10P_T1_D14_14) G4(IO_L12P_T1_MRCC_34) G11(IO_L12P_T1_MRCC_14) H3(IO_L13N_T2_MRCC_34) H4(IO_L13P_T2_MRCC_34) H11(IO_L13P_T2_MRCC_14) J3(IO_L17N_T2_34) J4(IO_L17P_T2_34) J11(IO_L17P_T2_D30_14) J12(IO_L17N_T2_D29_14) J13(IO_L18P_T2_D28_14) K3(IO_L16N_T2_34) K4(IO_L16P_T2_34) K11(IO_L19P_T3_D26_14) K12(IO_L19N_T3_D25_VREF_14) L1(IO_L18N_T2_34) L2(IO_L22N_T3_34) L3(IO_L22P_T3_34) L5(IO_25_34) L12(IO_L16P_T2_~{CSI}_14) L13(IO_L16N_T2_D31_14) L14(IO_L15N_T2_DQS_DOUT_~{CSO}_14) M1(IO_L18P_T2_34) M2(IO_L19N_T3_VREF_34) M3(IO_L19P_T3_34) M4(IO_L23N_T3_34) M5(IO_L23P_T3_34) M10(IO_25_14) M13(IO_L15P_T2_DQS_~{RDWR}_14) M14(IO_L21N_T3_DQS_D22_14) N1(IO_L20N_T3_34) N4(IO_L24N_T3_34) P2(IO_L20P_T3_34) P5(IO_L24P_T3_34)

### Layout directives
differential pair: JA1_N, JA1_P, JA2_N, JA2_P, JA3_N, JA3_P, JA4_N, JA4_P, JB1_N, JB1_P, JB2_N, JB2_P, JB3_N, JB3_P, JB4_N, JB4_P

### Notes on the sheet
- FPGA BANK 14 & 34:
- (near R500) DIS PULLUP
- Internal pullup config
- (near R501) only assemble one resistor
- (near R501) EN PULLUP
- (near U1) FPGA BANK 14 & 34
- UG475 p.28
- REV 1.0
- Spartan Project
- Louis Van Lommel

### Library data of the parts
C500-C514 = Cap: Capacitor; Published: 8-Jun-2000; LatestRevisionDate: 17-Jul-2002; LatestRevisionNote: Re-released for DXP Platform.; PackageReference: RAD-0.3; Publisher: Altium Limited; PackageDescription: Radial Cap, Thru-Hole; 2 Leads; 0.3 in Pin Spacing
  C504 C505 C511 C512: Value: 4.7u
  C514: Value: 100n
R500 R502 = Res2: Resistor; Published: 8-Jun-2000; LatestRevisionDate: 17-Jul-2002; LatestRevisionNote: Re-released for DXP Platform.; PackageReference: AXIAL-0.4; Publisher: Altium Limited; PackageDescription: Axial Device, Thru-Hole; 2 Leads; 0.4 in Pin Spacing
R501 = Res2: Resistor Enable pullup BANK FPGA; Populated: DNP; Published: 8-Jun-2000; LatestRevisionDate: 17-Jul-2002; LatestRevisionNote: Re-released for DXP Platform.; PackageReference: AXIAL-0.4; Publisher: Altium Limited; PackageDescription: Axial Device, Thru-Hole; 2 Leads; 0.4 in Pin Spacing
U1 = CMP-17530-000008-1: as U1 on sheet FPGA_POWER; Lead Free: Yes; Device Class L1: Integrated Circuits (ICs); Category: IC; Ipc Land Pattern Name: BGA196C100P14X14_1500X1500X146; Manufacturer Part Number: XC7S6-1FTGB196C; Temperature Range High: +85°C; ComponentLink2Description: Datasheet; Package: XC7S6-1FTGB196C; Height: 1.55mm; Device Class L2: Embedded Processors and Controllers; Digikey Description: XC7S6-1FTGB196C; Temperature: 0°C to +85°C; Device Class L3: FPGAs - Field Programmable Gate Arrays; Automotive: No; Octopart: https://octopart.com/xc7s6-1ftgb196c-xilinx-81890684; Footprint Url: https://www.xilinx.com/support/documentation/user_guides/ug475_7Series_Pkg_Pinout.pdf; ComponentLink2URL: https://www.xilinx.com/support/documentation/data_sheets/ds189-spartan-7-data-sheet.pdf; RoHS: TRUE; Temperature Range Low: 0°C
X500 = Oscillator: 12Mhz oscillator

## Sheet GPIO.SchDoc
size A4
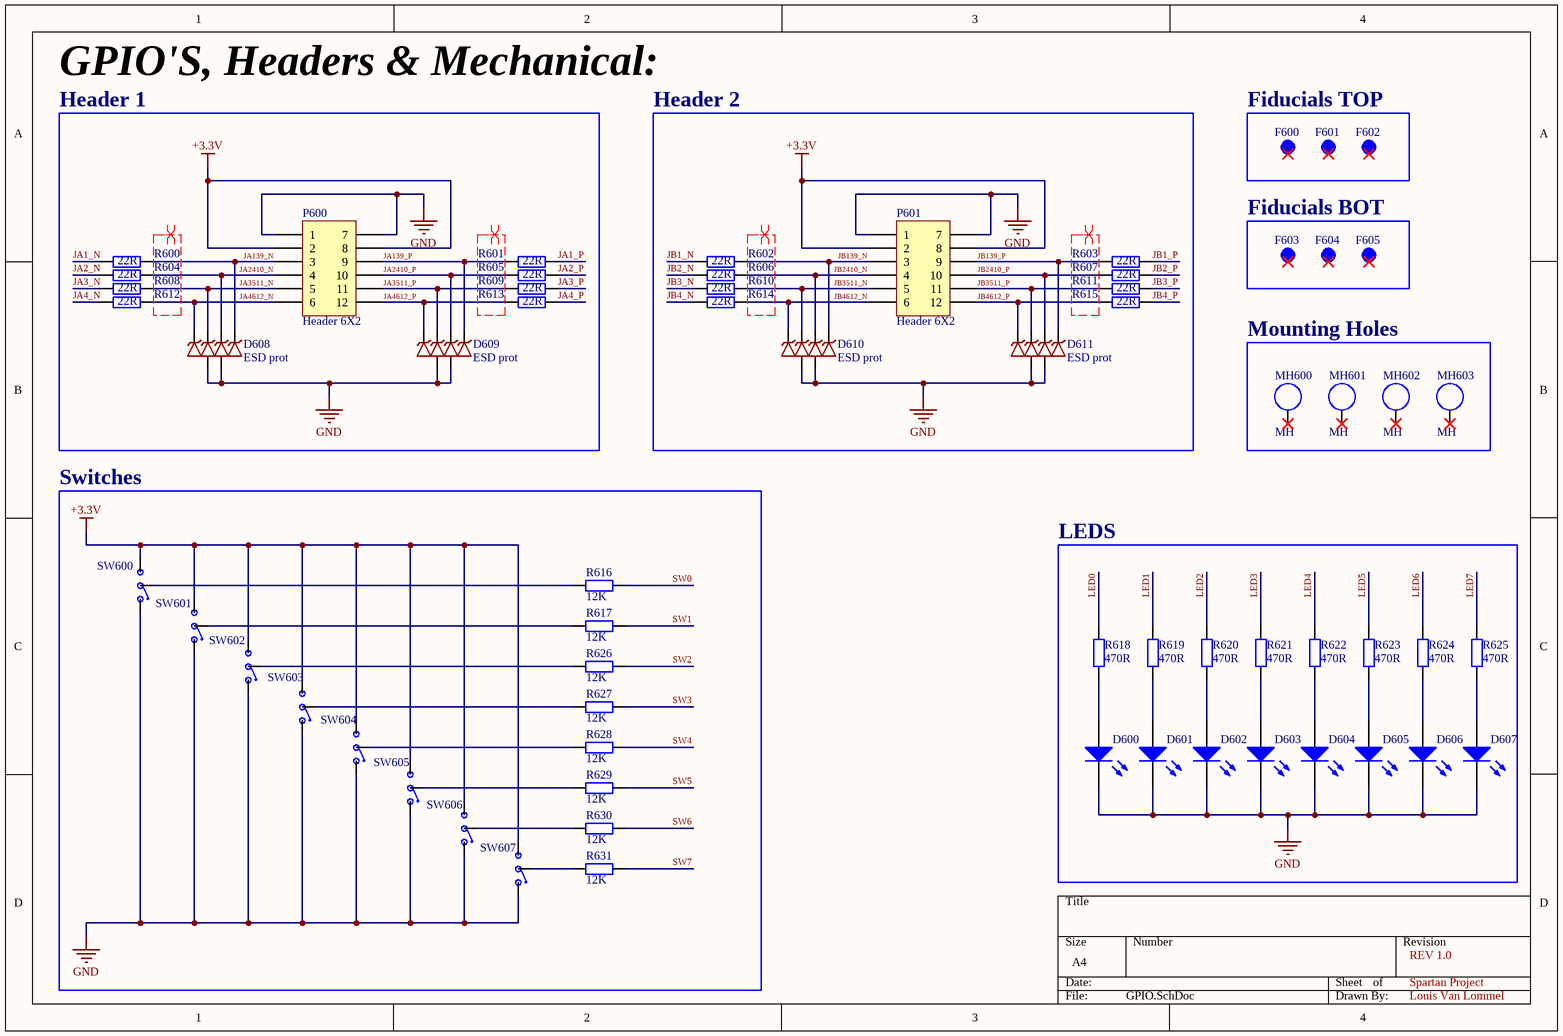
[diagram p6: GPIO.SchDoc]

### Parts
D600  LED  [LED_0603]  (value not drawn)
D601  LED  [LED_0603]  (value not drawn)
D602  LED  [LED_0603]  (value not drawn)
D603  LED  [LED_0603]  (value not drawn)
D604  LED  [LED_0603]  (value not drawn)
D605  LED  [LED_0603]  (value not drawn)
D606  LED  [LED_0603]  (value not drawn)
D607  LED  [LED_0603]  (value not drawn)
D608  ESD prot  [SOT457]
D609  ESD prot  [SOT457]
D610  ESD prot  [SOT457]
D611  ESD prot  [SOT457]
F600  Fiducial  [Fiducial30mil]  (value not drawn)  (no BOM)
F601  Fiducial  [Fiducial30mil]  (value not drawn)  (no BOM)
F602  Fiducial  [Fiducial30mil]  (value not drawn)  (no BOM)
F603  Fiducial  [Fiducial30mil]  (value not drawn)  (no BOM)
F604  Fiducial  [Fiducial30mil]  (value not drawn)  (no BOM)
F605  Fiducial  [Fiducial30mil]  (value not drawn)  (no BOM)
MH600  MH  [MH3.2mm]  (no BOM)
MH601  MH  [MH3.2mm]  (no BOM)
MH602  MH  [MH3.2mm]  (no BOM)
MH603  MH  [MH3.2mm]  (no BOM)
P600  Header 6X2  [HDR2X6_CEN]
P601  Header 6X2  [HDR2X6_CEN]
R600  value 22R  [RES_0603]  (hidden comment: 22)
R601  value 22R  [RES_0603]  (hidden comment: 22)
R602  value 22R  [RES_0603]  (hidden comment: 22)
R603  value 22R  [RES_0603]  (hidden comment: 22)
R604  value 22R  [RES_0603]  (hidden comment: 22)
R605  value 22R  [RES_0603]  (hidden comment: 22)
R606  value 22R  [RES_0603]  (hidden comment: 22)
R607  value 22R  [RES_0603]  (hidden comment: 22)
R608  value 22R  [RES_0603]  (hidden comment: 22)
R609  value 22R  [RES_0603]  (hidden comment: 22)
R610  value 22R  [RES_0603]  (hidden comment: 22)
R611  value 22R  [RES_0603]  (hidden comment: 22)
R612  value 22R  [RES_0603]  (hidden comment: 22)
R613  value 22R  [RES_0603]  (hidden comment: 22)
R614  value 22R  [RES_0603]  (hidden comment: 22)
R615  value 22R  [RES_0603]  (hidden comment: 22)
R616  12K  [RES_0603]
R617  12K  [RES_0603]
R618  value 470R  [RES_0603]  (hidden comment: 470)
R619  value 470R  [RES_0603]  (hidden comment: 470)
R620  value 470R  [RES_0603]  (hidden comment: 470)
R621  value 470R  [RES_0603]  (hidden comment: 470)
R622  value 470R  [RES_0603]  (hidden comment: 470)
R623  value 470R  [RES_0603]  (hidden comment: 470)
R624  value 470R  [RES_0603]  (hidden comment: 470)
R625  value 470R  [RES_0603]  (hidden comment: 470)
R626  12K  [RES_0603]
R627  12K  [RES_0603]
R628  12K  [RES_0603]
R629  12K  [RES_0603]
R630  12K  [RES_0603]
R631  12K  [RES_0603]
SW600  SPDT SW  [SPDT SWITCH]  (value not drawn)
SW601  SPDT SW  [SPDT SWITCH]  (value not drawn)
SW602  SPDT SW  [SPDT SWITCH]  (value not drawn)
SW603  SPDT SW  [SPDT SWITCH]  (value not drawn)
SW604  SPDT SW  [SPDT SWITCH]  (value not drawn)
SW605  SPDT SW  [SPDT SWITCH]  (value not drawn)
SW606  SPDT SW  [SPDT SWITCH]  (value not drawn)
SW607  SPDT SW  [SPDT SWITCH]  (value not drawn)

### Blocks framed on the sheet
Header 1: D608 D609 P600 R600 R601 R604 R605 R608 R609 R612 R613
Header 2: D610 D611 P601 R602 R603 R606 R607 R610 R611 R614 R615
Fiducials TOP: F600-F602
Fiducials BOT: F603-F605
Mounting Holes: MH600-MH603
Switches: R616 R617 R626-R631 SW600-SW607
LEDS: D600-D607 R618-R625

### Nets
+3.3V: P600.2 P600.8 P601.2 P601.8 SW600.1 SW601.1 SW602.1 SW603.1 SW604.1 SW605.1 SW606.1 SW607.1
GND: D600.2(K) D601.2(K) D602.2(K) D603.2(K) D604.2(K) D605.2(K) D606.2(K) D607.2(K) D608.5 D608.6 D609.5 D609.6 D610.5 D610.6 D611.5 D611.6 P600.1 P600.7 P601.1 P601.7 SW600.3 SW601.3 SW602.3 SW603.3 SW604.3 SW605.3 SW606.3 SW607.3
JA1_N: R600.2
JA1_P: R601.1
JA2_N: R604.2
JA2_P: R605.1
JA3_N: R608.2
JA3_P: R609.1
JA4_N: R612.2
JA4_P: R613.1
JA139_N: D608.4 P600.3 R600.1
JA139_P: D609.4 P600.9 R601.2
JA2410_N: D608.3 P600.4 R604.1
JA2410_P: D609.3 P600.10 R605.2
JA3511_N: D608.2 P600.5 R608.1
JA3511_P: D609.2 P600.11 R609.2
JA4612_N: D608.1 P600.6 R612.1
JA4612_P: D609.1 P600.12 R613.2
JB1_N: R602.2
JB1_P: R603.1
JB2_N: R606.2
JB2_P: R607.1
JB3_N: R610.2
JB3_P: R611.1
JB4_N: R614.2
JB4_P: R615.1
JB139_N: D610.4 P601.3 R602.1
JB139_P: D611.4 P601.9 R603.2
JB2410_N: D610.3 P601.4 R606.1
JB2410_P: D611.3 P601.10 R607.2
JB3511_N: D610.2 P601.5 R610.1
JB3511_P: D611.2 P601.11 R611.2
JB4612_N: D610.1 P601.6 R614.1
JB4612_P: D611.1 P601.12 R615.2
LED0: R618.2
LED1: R619.2
LED2: R620.2
LED3: R621.2
LED4: R622.2
LED5: R623.2
LED6: R624.2
LED7: R625.2
SW0: R616.1
SW1: R617.1
SW2: R626.1
SW3: R627.1
SW4: R628.1
SW5: R629.1
SW6: R630.1
SW7: R631.1
NetD600_1: D600.1(A) R618.1
NetD601_1: D601.1(A) R619.1
NetD602_1: D602.1(A) R620.1
NetD603_1: D603.1(A) R621.1
NetD604_1: D604.1(A) R622.1
NetD605_1: D605.1(A) R623.1
NetD606_1: D606.1(A) R624.1
NetD607_1: D607.1(A) R625.1
NetR616_2: R616.2 SW600.2
NetR617_2: R617.2 SW601.2
NetR626_2: R626.2 SW602.2
NetR627_2: R627.2 SW603.2
NetR628_2: R628.2 SW604.2
NetR629_2: R629.2 SW605.2
NetR630_2: R630.2 SW606.2
NetR631_2: R631.2 SW607.2

Not connected (* = marked no-connect by the designer): F600 1*; F601 1*; F602 1*; F603 1*; F604 1*; F605 1*; MH600 1*; MH601 1*; MH602 1*; MH603 1*

### Layout directives
differential pair: (no net found under the mark)

### Notes on the sheet
- GPIO'S, Headers & Mechanical:
- REV 1.0
- Spartan Project
- Louis Van Lommel

### Library data of the parts
D600-D607 = LED0: Typical INFRARED GaAs LED; Published: 8-Jun-2000; LatestRevisionDate: 08-Jul-2005; LatestRevisionNote: Mech Layer 1 removed.; PackageReference: LED-0; Publisher: Altium Limited; PackageDescription: LED; 2 Leads
D608-D611 = ESD prot: NEXPERIA BZA462A,125
F600-F605 = Fiducial: 30mil Fiducial
MH600-MH603 = MH: 3.2mm mounting hole
P600 P601 = Header 6X2A: Header, 6-Pin, Dual row; LatestRevisionDate: 17-Jul-2002; LatestRevisionNote: Re-released for DXP Platform.; Publisher: Altium Limited
R600-R631 = Res2: Resistor; Published: 8-Jun-2000; LatestRevisionDate: 17-Jul-2002; LatestRevisionNote: Re-released for DXP Platform.; PackageReference: AXIAL-0.4; Publisher: Altium Limited; PackageDescription: Axial Device, Thru-Hole; 2 Leads; 0.4 in Pin Spacing
  R616 R617 R626-R631: Value: 12K

## Nets that join several sheets
+1.0V: FPGA_POWER (19 pins), POWER_SUPPLY (5 pins)
+1.8V: FPGA_POWER (8 pins), POWER_SUPPLY (5 pins), USB (8 pins)
+3.3V: POWER_SUPPLY (6 pins), USB (23 pins), FPGA_CONFIG (15 pins), FPGA_BANKS (24 pins), GPIO (12 pins)
GND: FPGA_POWER (60 pins), POWER_SUPPLY (17 pins), USB (30 pins), FPGA_CONFIG (8 pins), FPGA_BANKS (17 pins), GPIO (28 pins)
D_N: POWER_SUPPLY (D100.6), USB (U300.7)
D_P: POWER_SUPPLY (D100.4), USB (U300.8)
FLASH_CS: FPGA_CONFIG (R406.1 U401.1), FPGA_BANKS (U1.C11)
FLASH_DQ0: FPGA_CONFIG (R407.2), FPGA_BANKS (U1.B11)
FLASH_DQ1: FPGA_CONFIG (R408.2), FPGA_BANKS (U1.B12)
FLASH_DQ2: FPGA_CONFIG (R412.2), FPGA_BANKS (U1.D10)
FLASH_DQ3: FPGA_CONFIG (R413.2), FPGA_BANKS (U1.C10)
JA1_N: FPGA_BANKS (U1.J1), GPIO (R600.2)
JA1_P: FPGA_BANKS (U1.J2), GPIO (R601.1)
JA2_N: FPGA_BANKS (U1.H1), GPIO (R604.2)
JA2_P: FPGA_BANKS (U1.H2), GPIO (R605.1)
JA3_N: FPGA_BANKS (U1.F1), GPIO (R608.2)
JA3_P: FPGA_BANKS (U1.G1), GPIO (R609.1)
JA4_N: FPGA_BANKS (U1.C1), GPIO (R612.2)
JA4_P: FPGA_BANKS (U1.D1), GPIO (R613.1)
JB1_N: FPGA_BANKS (U1.M12), GPIO (R602.2)
JB1_P: FPGA_BANKS (U1.M11), GPIO (R603.1)
JB2_N: FPGA_BANKS (U1.P13), GPIO (R606.2)
JB2_P: FPGA_BANKS (U1.P12), GPIO (R607.1)
JB3_N: FPGA_BANKS (U1.P11), GPIO (R610.2)
JB3_P: FPGA_BANKS (U1.P10), GPIO (R611.1)
JB4_N: FPGA_BANKS (U1.N11), GPIO (R614.2)
JB4_P: FPGA_BANKS (U1.N10), GPIO (R615.1)
LED0: FPGA_BANKS (U1.J14), GPIO (R618.2)
LED1: FPGA_BANKS (U1.F14), GPIO (R619.2)
LED2: FPGA_BANKS (U1.A5), GPIO (R620.2)
LED3: FPGA_BANKS (U1.A4), GPIO (R621.2)
LED4: FPGA_BANKS (U1.A3), GPIO (R622.2)
LED5: FPGA_BANKS (U1.A2), GPIO (R623.2)
LED6: FPGA_BANKS (U1.C3), GPIO (R624.2)
LED7: FPGA_BANKS (U1.D4), GPIO (R625.2)
SW0: FPGA_BANKS (U1.N14), GPIO (R616.1)
SW1: FPGA_BANKS (U1.G14), GPIO (R617.1)
SW2: FPGA_BANKS (U1.B6), GPIO (R626.1)
SW3: FPGA_BANKS (U1.B5), GPIO (R627.1)
SW4: FPGA_BANKS (U1.B3), GPIO (R628.1)
SW5: FPGA_BANKS (U1.B2), GPIO (R629.1)
SW6: FPGA_BANKS (U1.C4), GPIO (R630.1)
SW7: FPGA_BANKS (U1.D3), GPIO (R631.1)
TCK: USB (R301.1), FPGA_CONFIG (U1.A7)
TDI: USB (R302.1), FPGA_CONFIG (U1.P7)
TDO: USB (R303.1), FPGA_CONFIG (U1.P6)
TMS: USB (R304.1), FPGA_CONFIG (U1.M6)
UART0_RX: USB (U300.38), FPGA_BANKS (U1.P3)
UART0_TX: USB (U300.39), FPGA_BANKS (U1.P4)